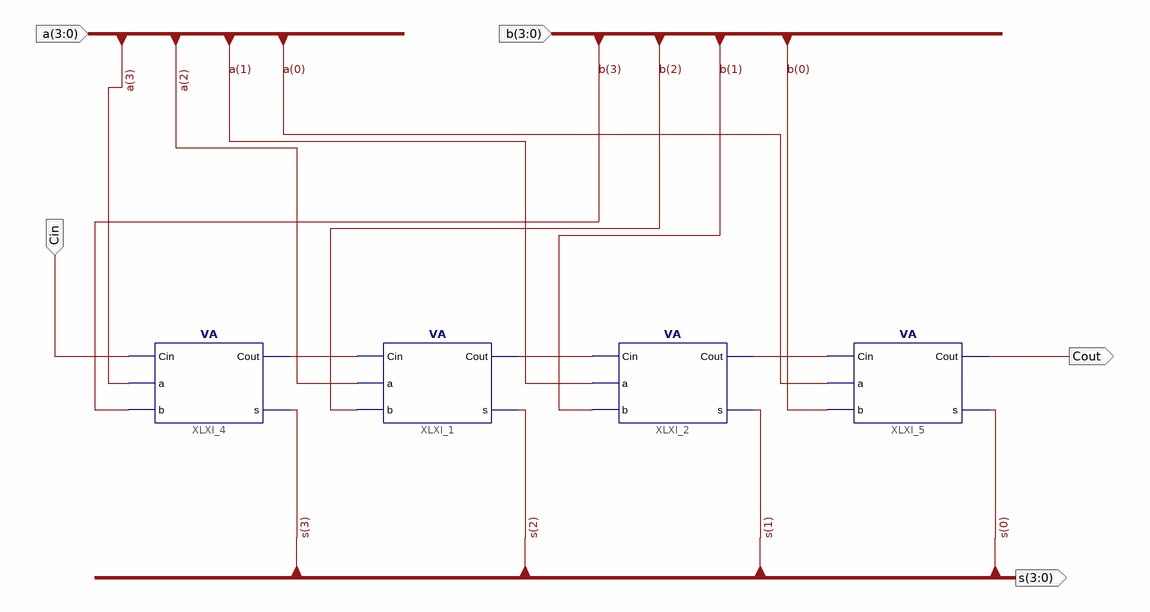
[diagram p0: schematic sheet 1]
// Xilinx ISE schematic RCA_4.sch (spartan3e) as structural Verilog: 4 symbols, 5 ports
module RCA_4 (
  input  Cin,
  input  [3:0] a,
  input  [3:0] b,
  output Cout,
  output [3:0] s
);

  wire XLXN_2, XLXN_3, XLXN_12;

  VA XLXI_1 (.Cin(XLXN_12), .a(a[2]), .b(b[2]), .Cout(XLXN_2), .s(s[2]));
  VA XLXI_2 (.Cin(XLXN_2), .a(a[1]), .b(b[1]), .Cout(XLXN_3), .s(s[1]));
  VA XLXI_5 (.Cin(XLXN_3), .a(a[0]), .b(b[0]), .Cout(Cout), .s(s[0]));
  VA XLXI_4 (.Cin(Cin), .a(a[3]), .b(b[3]), .Cout(XLXN_12), .s(s[3]));
endmodule
